# Altium schematic sheet Variable Output 1.SchDoc
size A4
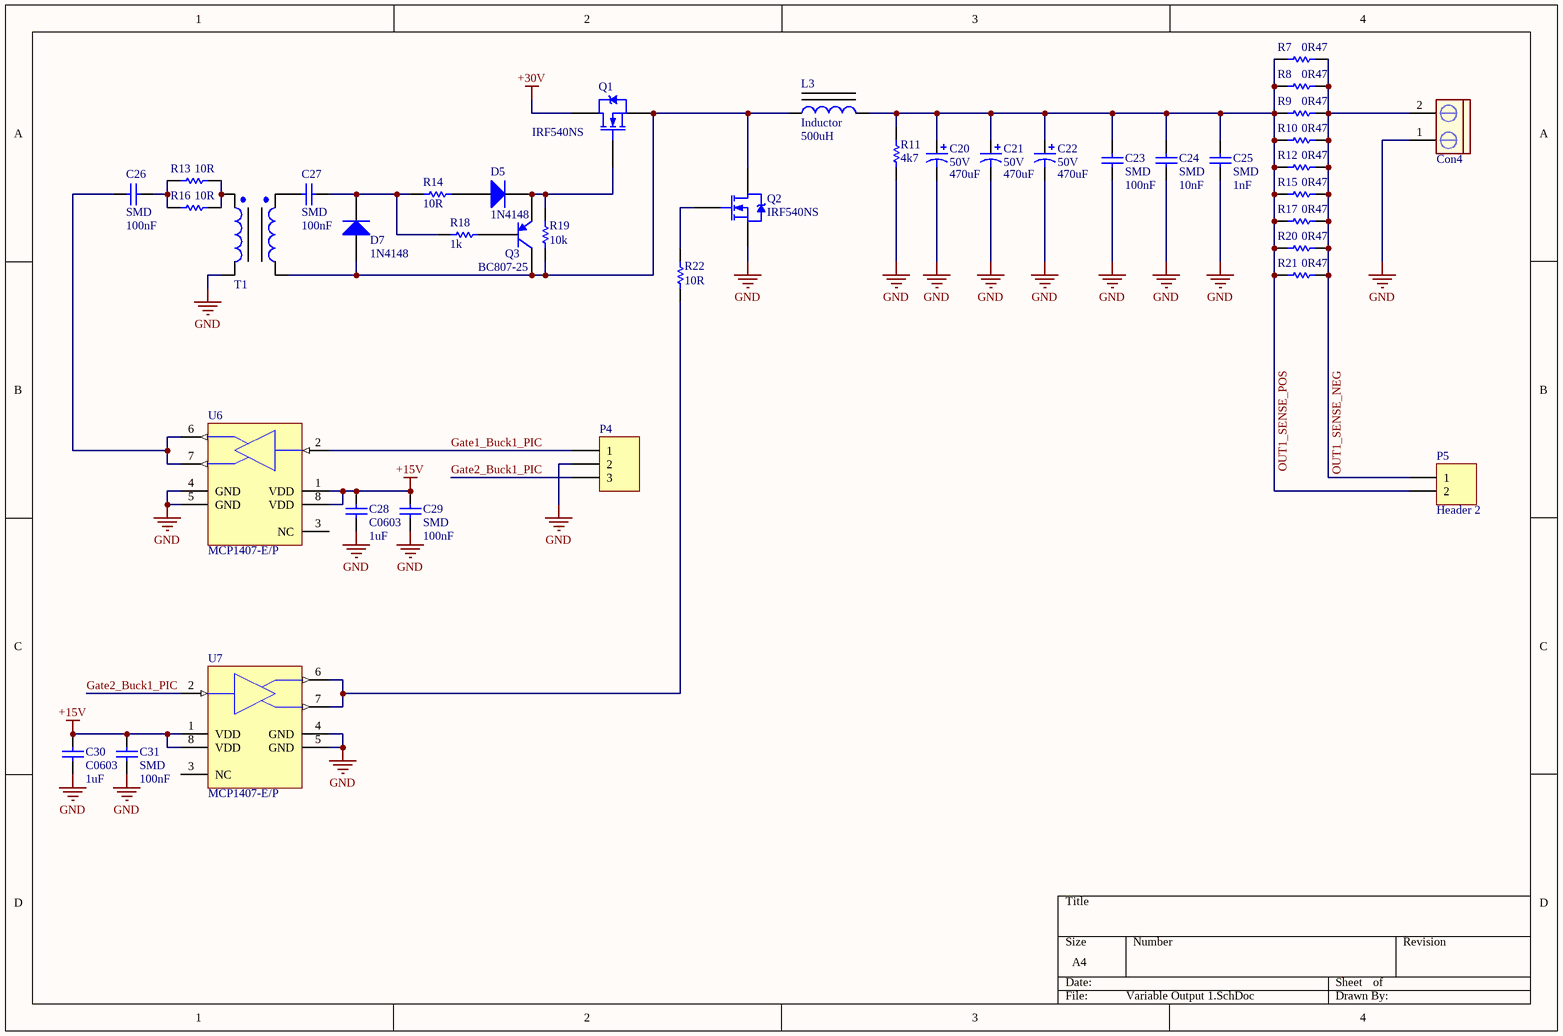
[diagram p0: Variable Output 1.SchDoc]

## Parts
C20  50V  value 470uF  [CAPPR5-10X20]
C21  50V  value 470uF  [CAPPR5-10X20]
C22  50V  value 470uF  [CAPPR5-10X20]
C23  SMD  value 100nF  [1206]
C24  SMD  value 10nF  [1206]
C25  SMD  value 1nF  [1206]
C26  SMD  value 100nF  [1206]
C27  SMD  value 100nF  [1206]
C28  C0603  value 1uF  [0603]
C29  SMD  value 100nF  [1206]
C30  C0603  value 1uF  [0603]
C31  SMD  value 100nF  [1206]
Con4  Salida Buck  [My_CN2]  (value not drawn)
D5  1N4148  [SOD80C]
D7  1N4148  [SOD80C]
L3  Inductor  value 500uH  [R33x19x11 Toroid Vertical]
P4  Header 3  [My_1X03]  (value not drawn)
P5  Header 2  [HDR1X2]
Q1  IRF540NS  [D2PAK_N]
Q2  IRF540NS  [D2PAK_N]
Q3  BC807-25  [SOT-23A_N]
R7  value 0R47  [AXIAL-0.3]  (hidden comment: Carbon)
R8  value 0R47  [AXIAL-0.3]  (hidden comment: Carbon)
R9  value 0R47  [AXIAL-0.3]  (hidden comment: Carbon)
R10  value 0R47  [AXIAL-0.3]  (hidden comment: Carbon)
R11  value 4k7  [8RB-1206]  (hidden comment: SMD)
R12  value 0R47  [AXIAL-0.3]  (hidden comment: Carbon)
R13  value 10R  [8RB-1206]  (hidden comment: SMD 1206)
R14  value 10R  [8RB-1206]  (hidden comment: SMD 1206)
R15  value 0R47  [AXIAL-0.3]  (hidden comment: Carbon)
R16  value 10R  [8RB-1206]  (hidden comment: SMD 1206)
R17  value 0R47  [AXIAL-0.3]  (hidden comment: Carbon)
R18  value 1k  [8RB-1206]  (hidden comment: SMD)
R19  value 10k  [8RB-1206]  (hidden comment: SMD)
R20  value 0R47  [AXIAL-0.3]  (hidden comment: Carbon)
R21  value 0R47  [AXIAL-0.3]  (hidden comment: Carbon)
R22  value 10R  [8RB-1206]  (hidden comment: SMD 1206)
T1  Gate Driver Transformer 15mm Toroidal  [Gate Driver Transformer 15mm Toroidal]  (value not drawn)
U6  MCP1407-E/P  [PDIP300-P8]
U7  MCP1407-E/P  [PDIP300-P8]

## Nets
+15V: C28.2 C29.2 C30.2 C31.2 U6.1(VDD) U6.8(VDD) U7.1(VDD) U7.8(VDD)
+30V: Q1.2(D)
GND: C20.2 C21.2 C22.2 C23.1 C24.1 C25.1 C28.1 C29.1 C30.1 C31.1 Con4.1 P4.2 Q2.3(S) R11.1 T1.2 U6.4(GND) U6.5(GND) U7.4(GND) U7.5(GND)
Gate1_Buck1_PIC: P4.1 U6.2(IN)
Gate2_Buck1_PIC: P4.3 U7.2(IN)
OUT1_SENSE_NEG: Con4.2 P5.1 R7.2 R8.2 R9.2 R10.2 R12.2 R15.2 R17.2 R20.2 R21.2
OUT1_SENSE_POS: C20.1 C21.1 C22.1 C23.2 C24.2 C25.2 L3.2 P5.2 R7.1 R8.1 R9.1 R10.1 R11.2 R12.1 R15.1 R17.1 R20.1 R21.1
NetC26_1: C26.1 U6.6(OUT) U6.7(OUT)
NetC26_2: C26.2 R13.1 R16.1
NetC27_1: C27.1 T1.3
NetC27_2: C27.2 D7.2(K) R14.1 R18.2
NetD5_1: D5.1(A) R14.2
NetD5_2: D5.2(K) Q1.1(G) Q3.2(E) R19.2
NetD7_1: D7.1(A) L3.1 Q1.3(S) Q2.2(D) Q3.3(C) R19.1 T1.4
NetQ2_1: Q2.1(G) R22.1
NetQ3_1: Q3.1(B) R18.1
NetR13_2: R13.2 R16.2 T1.1
NetR22_2: R22.2 U7.6(OUT) U7.7(OUT)

Not connected (* = marked no-connect by the designer): U6 3(NC); U7 3(NC)

## Library data of the parts
C20-C22 = EKB00DE347H00: Aluminum Electrolytic Capacitor, Radial Style with Long Leads: 470uF, 50V; Note: Refer to Manufacturer's Data Sheets for other lead formations; DrillSize: Nominal, Rounded To The Nearest 0.1mm; Published: 19-Mar-2004; DatasheetDocument: 21-Feb-2001; PackageReference: CAPPR5-10X20; Publisher: Altium Limited; ComponentLink1Description: Manufacturer Link; ComponentLink1URL: http://www.vishay.com/; ComponentLink2Description: Datasheet; ComponentLink2URL: http://www.vishay.com/docs/25013/ekb.pdf
C23-C27 C29 C31 = C1206: Ceramic Chip Capacitor - Standard; Published: 17-Jul-2002; LatestRevisionDate: 19-Mar-2004; LatestRevisionNote: Silkscreen size reduced.; DatasheetDocument: Mar-2001; PackageDocument: Mar-2001; PackageReference: 1206; Publisher: Altium Limited; Code_JEITA: 1206; Code_IPC: 3216 [1206]; ComponentLink1Description: Manufacturer Link; ComponentLink1URL: http://www.kemet.com/; ComponentLink2Description: Datasheet; ComponentLink2URL: http://www.kemet.com/kemet/web/homepage/kechome.nsf/vapubfilesname/F3102TA.pdf/$file/F3102TA.pdf
C28 C30 = C0603: C1608X7R1C105K X7R; Note: Footprint corresponds to dimensions for bulk cassette packaging. This case size has tightened tolerances.; Published: 17-Jul-2002; LatestRevisionDate: 19-Mar-2004; LatestRevisionNote: Silkscreen size reduced.; DatasheetDocument: Mar-2001; PackageDocument: Mar-2001; PackageReference: 0603; Publisher: Altium Limited; Code_JEITA: 0603; Code_IPC: 1608 [0603]; ComponentLink1Description: Manufacturer Link; ComponentLink1URL: http://www.kemet.com/; ComponentLink2Description: Datasheet; ComponentLink2URL: http://www.kemet.com/kemet/web/homepage/kechome.nsf/vapubfilesname/F3102TA.pdf/$file/F3102TA.pdf
Con4 = CON2 pin blue: Connector blue screw
D5 D7 = 1N4148: High Conductance Fast Diode; Published: 8-Jun-2000; LatestRevisionDate: 17-Jul-2002; LatestRevisionNote: Re-released for DXP Platform.; DatasheetDocument: 1997; PackageReference: DO-35; Publisher: Altium Limited; Code_JEDEC: DO-204-AH; ComponentLink1Description: Manufacturer Link; ComponentLink1URL: http://www.fairchildsemi.com/; ComponentLink2Description: Datasheet; ComponentLink2URL: http://www.fairchildsemi.com/ds/1N%2F1N4148.pdf
L3 = Generic Inductor
P4 = Header 3: Header, 3-Pin; LatestRevisionDate: 17-Jul-2002; LatestRevisionNote: Re-released for DXP Platform.; Publisher: Altium Limited
P5 = Header 2: Header, 2-Pin; LatestRevisionDate: 17-Jul-2002; LatestRevisionNote: Re-released for DXP Platform.; Publisher: Altium Limited
Q1 Q2 = IRF540NS: HEXFET Power MOSFET; Published: 8-Jun-2000; LatestRevisionDate: 20-Nov-2009; LatestRevisionNote: IPC-7351 Footprint Added.; DatasheetVersion: May-1998; PackageReference: D2PAK; Publisher: Altium Limited; PackageDescription: 3-Pin Transistor Outline Package 2.54 mm Pitch, 15.1 mm Lead Span; ComponentLink1Description: Manufacturer Link; ComponentLink1URL: http://www.irf.com/; ComponentLink2Description: Datasheet; ComponentLink2URL: http://www.irf.com/product-info/datasheets/data/irf540ns.pdf
Q3 = BC807-25: PNP General Purpose Amplifier; Published: 8-Jun-2000; LatestRevisionDate: 20-Nov-2009; LatestRevisionNote: IPC-7351 Footprint Added.; DatasheetVersion: 1997; PackageVersion: Sep-1998; PackageReference: SOT-23A; Publisher: Altium Limited; PackageDescription: 3-Pin SOT-23 Package 0.95 mm Pitch, 2.3 mm Lead Span; ComponentLink1Description: Manufacturer Link; ComponentLink1URL: http://www.fairchildsemi.com/; ComponentLink2Description: Datasheet; ComponentLink2URL: http://www.fairchildsemi.com/ds/BC%2FBC807.pdf
R7-R10 R12 R15 R17 R20 R21 = Res1: Resistor; Published: 8-Jun-2000; LatestRevisionDate: 17-Jul-2002; LatestRevisionNote: Re-released for DXP Platform.; PackageReference: AXIAL-0.3; Publisher: Altium Limited; PackageDescription: Axial Device, Thru-Hole; 2 Leads; 0.3 in Pin Spacing
R11 R13 R14 R16 R18 R19 R22 = ERJ8BQ: Low Ohmic Value Thick Film Chip Resistor, 0.22 Ohm to 9.1 Ohm Range, 1%, 2% and 5% Tolerance, 1206 Size, 0.33 W; Published: 17-Dec-2003; LatestRevisionDate: 19-Mar-2004; LatestRevisionNote: Silkscreen size reduced.; PackageDocument: Mar-2003; PackageReference: 8RB-1206; Publisher: Altium Limited; Code_IPC: 3216 [1206]; ComponentLink1Description: Manufacturer Link; ComponentLink1URL: http://www.panasonic.com/industrial/components/resistive_products.htm; ComponentLink2Description: Datasheet; ComponentLink2URL: http://www.panasonic.com/industrial/components/pdf/AOA0000CE3.pdf
U6 U7 = MCP1407-E/P: 6A High-Speed Power MOSFET Drivers, Non Inverting, Extended Temperature; Published: 29-Jan-2009; LatestRevisionDate: 01-Mar-2010; LatestRevisionNote: Sch Layout changed.; DatasheetVersion: revA, Dec-2006; PackageVersion: revBB, Aug-2009; PackageReference: PDIP300-P8; Publisher: Altium Limited; PackageDescription: 8-Lead Plastic Dual In-Line (P) - 300 mil Body [PDIP]; Supplier 1: Digi-Key; Supplier Part Number 1: MCP1407-E/P-ND; Supplier 2: Farnell; Supplier Part Number 2: 1317124; Code_JEDEC: MS-001; ComponentLink1Description: Datasheet; ComponentLink1URL: http://ww1.microchip.com/downloads/en/DeviceDoc/22019a.pdf; ComponentLink2Description: Packaging Specification; ComponentLink2URL: http://www.microchip.com/stellent/groups/techpub_sg/documents/packagingspec/en012702.pdf; ComponentLink3Description: Microchip.com Home; ComponentLink3URL: http://www.microchip.com/